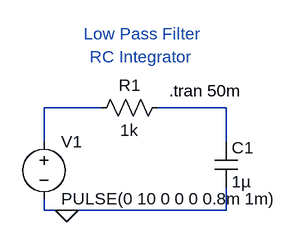
[diagram p0: schematic integrator.asc]
integrator.asc, the LTspice schematic file:
Version 4
SHEET 1 880 680
WIRE 96 32 16 32
WIRE 272 32 176 32
WIRE 16 80 16 32
WIRE 272 80 272 32
WIRE 16 176 16 160
WIRE 48 176 16 176
WIRE 272 176 272 144
WIRE 272 176 48 176
FLAG 48 176 0
SYMBOL res 192 16 R90
WINDOW 0 0 56 VBottom 2
WINDOW 3 32 56 VTop 2
SYMATTR InstName R1
SYMATTR Value 1k
SYMBOL cap 256 80 R0
SYMATTR InstName C1
SYMATTR Value 1µ
SYMBOL voltage 16 64 R0
WINDOW 123 0 0 Left 2
WINDOW 39 0 0 Left 2
SYMATTR InstName V1
SYMATTR Value PULSE(0 10 0 0 0 0.8m 1m)
TEXT 192 8 Left 2 !.tran 50m
TEXT 72 -72 Left 2 ;Low Pass Filter
TEXT 80 -40 Left 2 ;RC Integrator

The netlist it stands for:
* integrator.asc
R1 N002 N001 1k
C1 N002 0 1µ
V1 N001 0 PULSE(0 10 0 0 0 0.8m 1m)
.tran 50m
* Low Pass Filter
* RC Integrator
.backanno
.end